# Altium schematic sheet power.SchDoc
size A
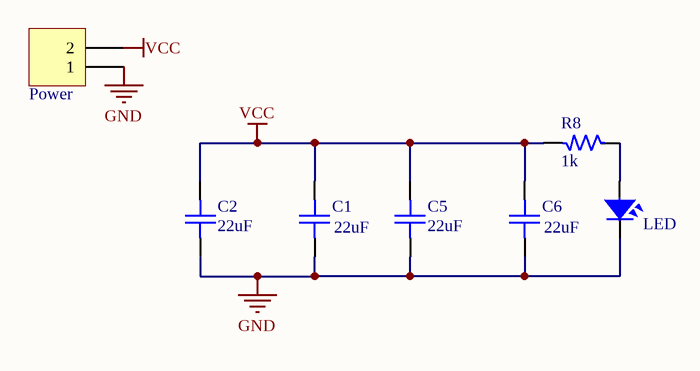
[diagram p0: power.SchDoc]

## Parts
C1  22uF  [CAPC-0603 (1608)]
C2  22uF  [CAPC-0603 (1608)]
C5  22uF  [CAPC-0603 (1608)]
C6  22uF  [CAPC-0603 (1608)]
LED  LED  [LED-3]  (value not drawn)
Power  Header 2_1  [HED2]  (value not drawn)
R8  1k  [SM-RES-1206]

## Nets
GND: C1.1 C2.1 C5.1 C6.1 LED.2 Power.1
VCC: C1.2 C2.2 C5.2 C6.2 Power.2 R8.2
NetLED_1: LED.1 R8.1

## Library data of the parts
C1 C2 C5 C6 = 0603N330J500CT: CAP CER 33pF 50V 5%  0603; MPN: CL10C330JB8NNNC, 0603N330J500CT; CompanyID: VT-01106; Solder: SMT; Value: 33p/50V; Category: CAPACITOR; PinCount: 2
LED = LED: LED Single colour Green and Red; Value: LED 3 ly Single Colour
Power = Header 2_1: Header, 2-Pin; Manufacturer: Generic Components; Class: Connector; Value: Header 2
R8 = R: Resistor 1/4W; Value: R1/4W - 1K